# EAGLE schematic AniBike_v2.8_BT_MainBoard (EAGLE 5.08)

## Sheet 1 of 2
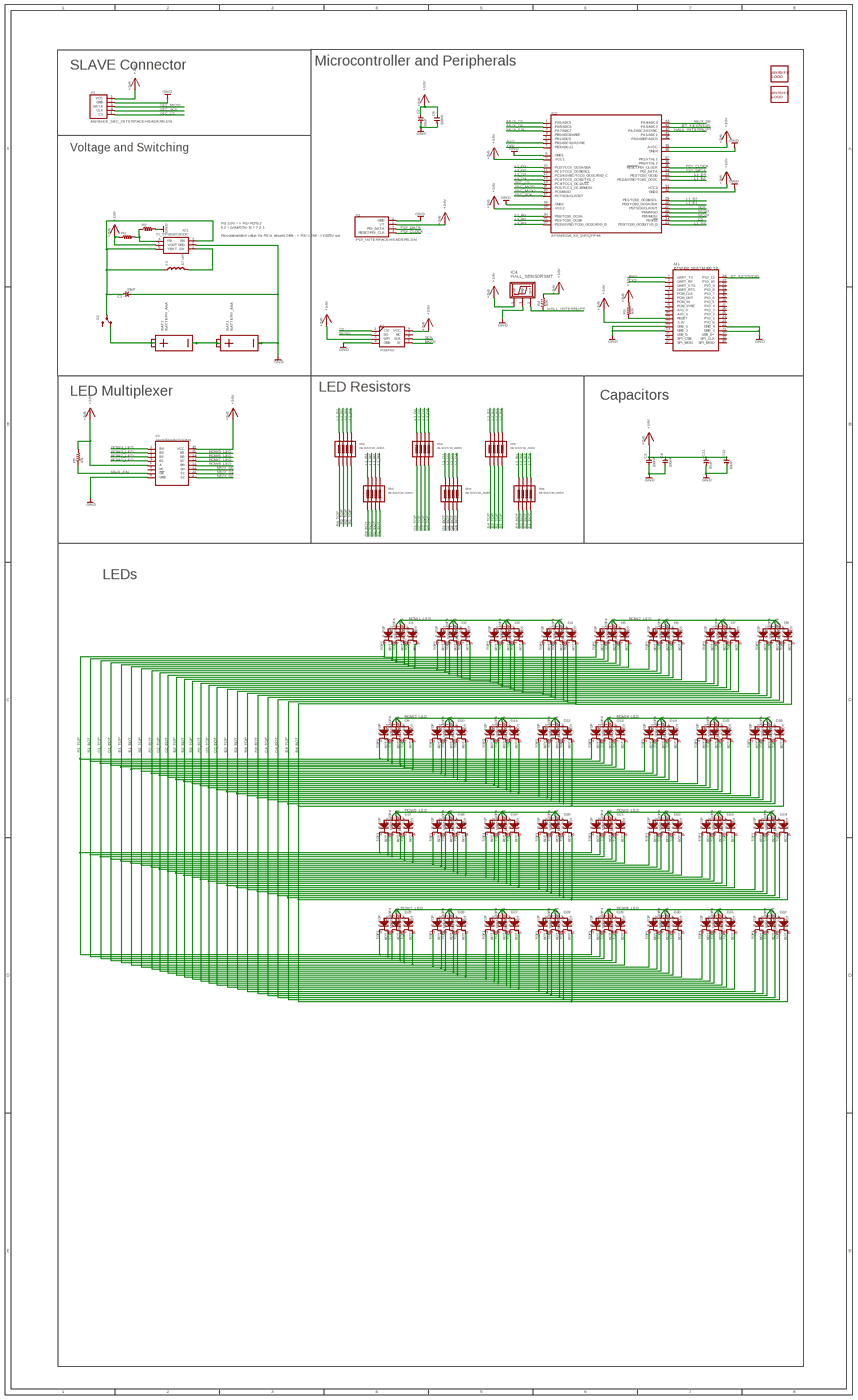
[diagram p0: schematic, sheet 1, overview]
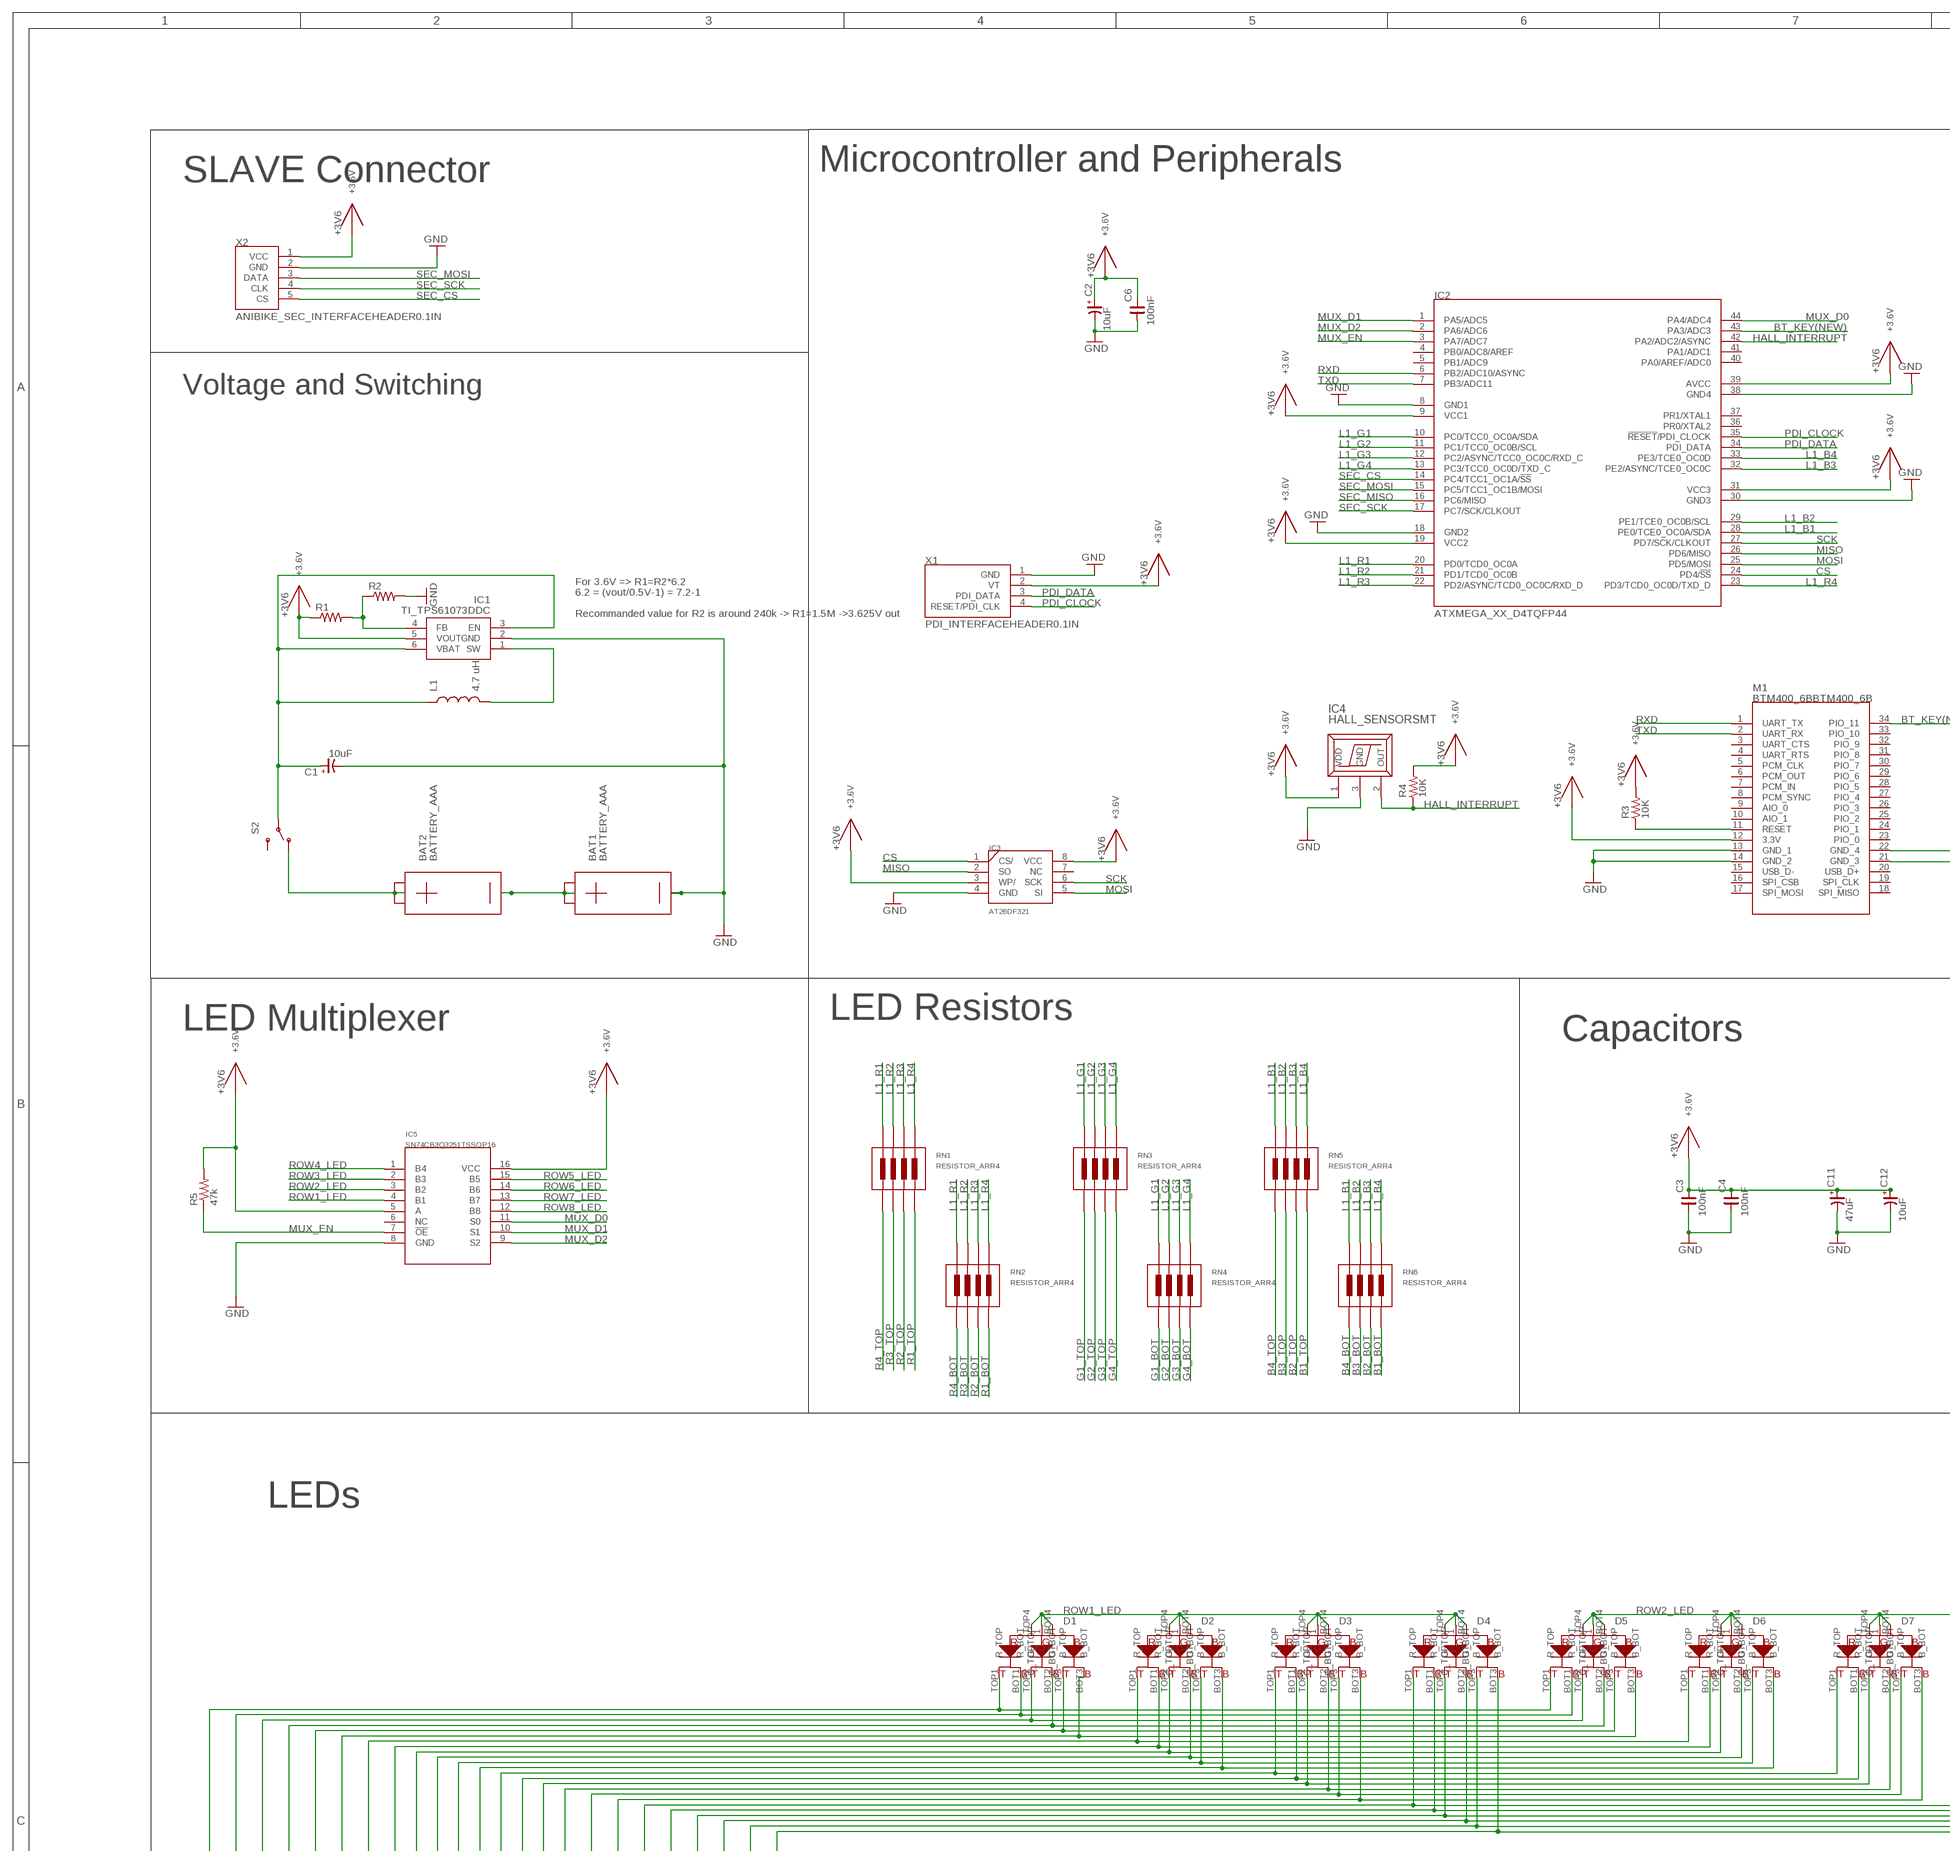
[diagram p1: schematic, sheet 1, part 1 of 4]
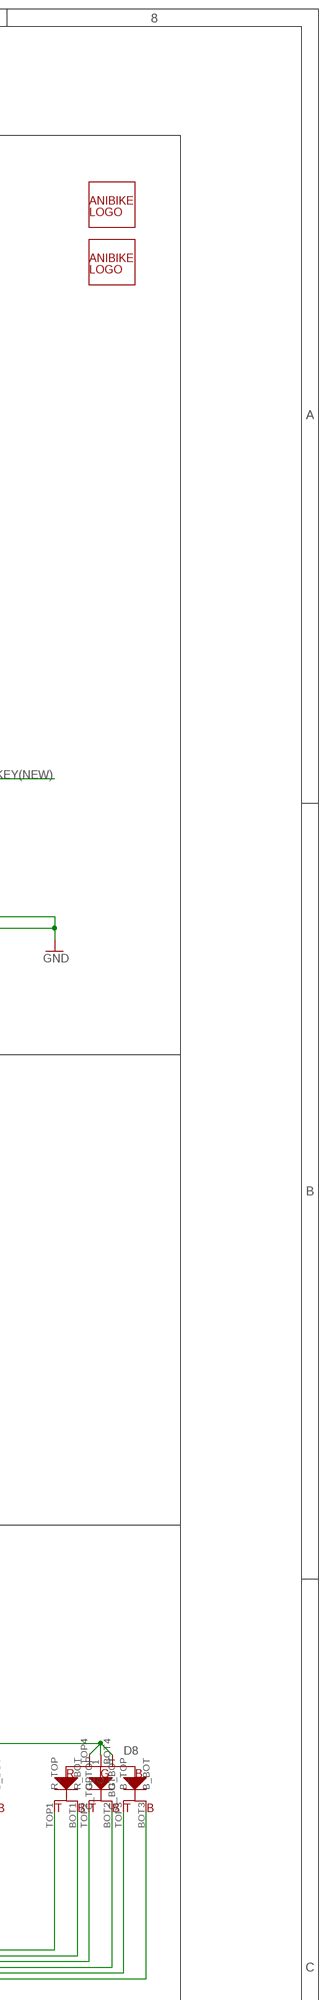
[diagram p2: schematic, sheet 1, part 2 of 4]
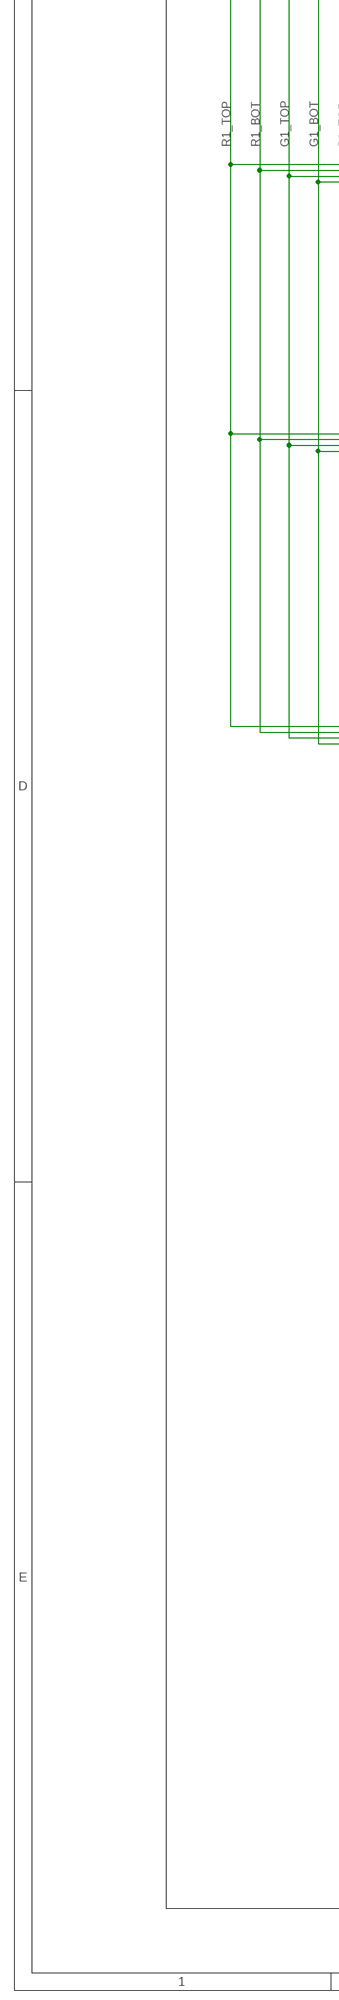
[diagram p3: schematic, sheet 1, part 3 of 4]
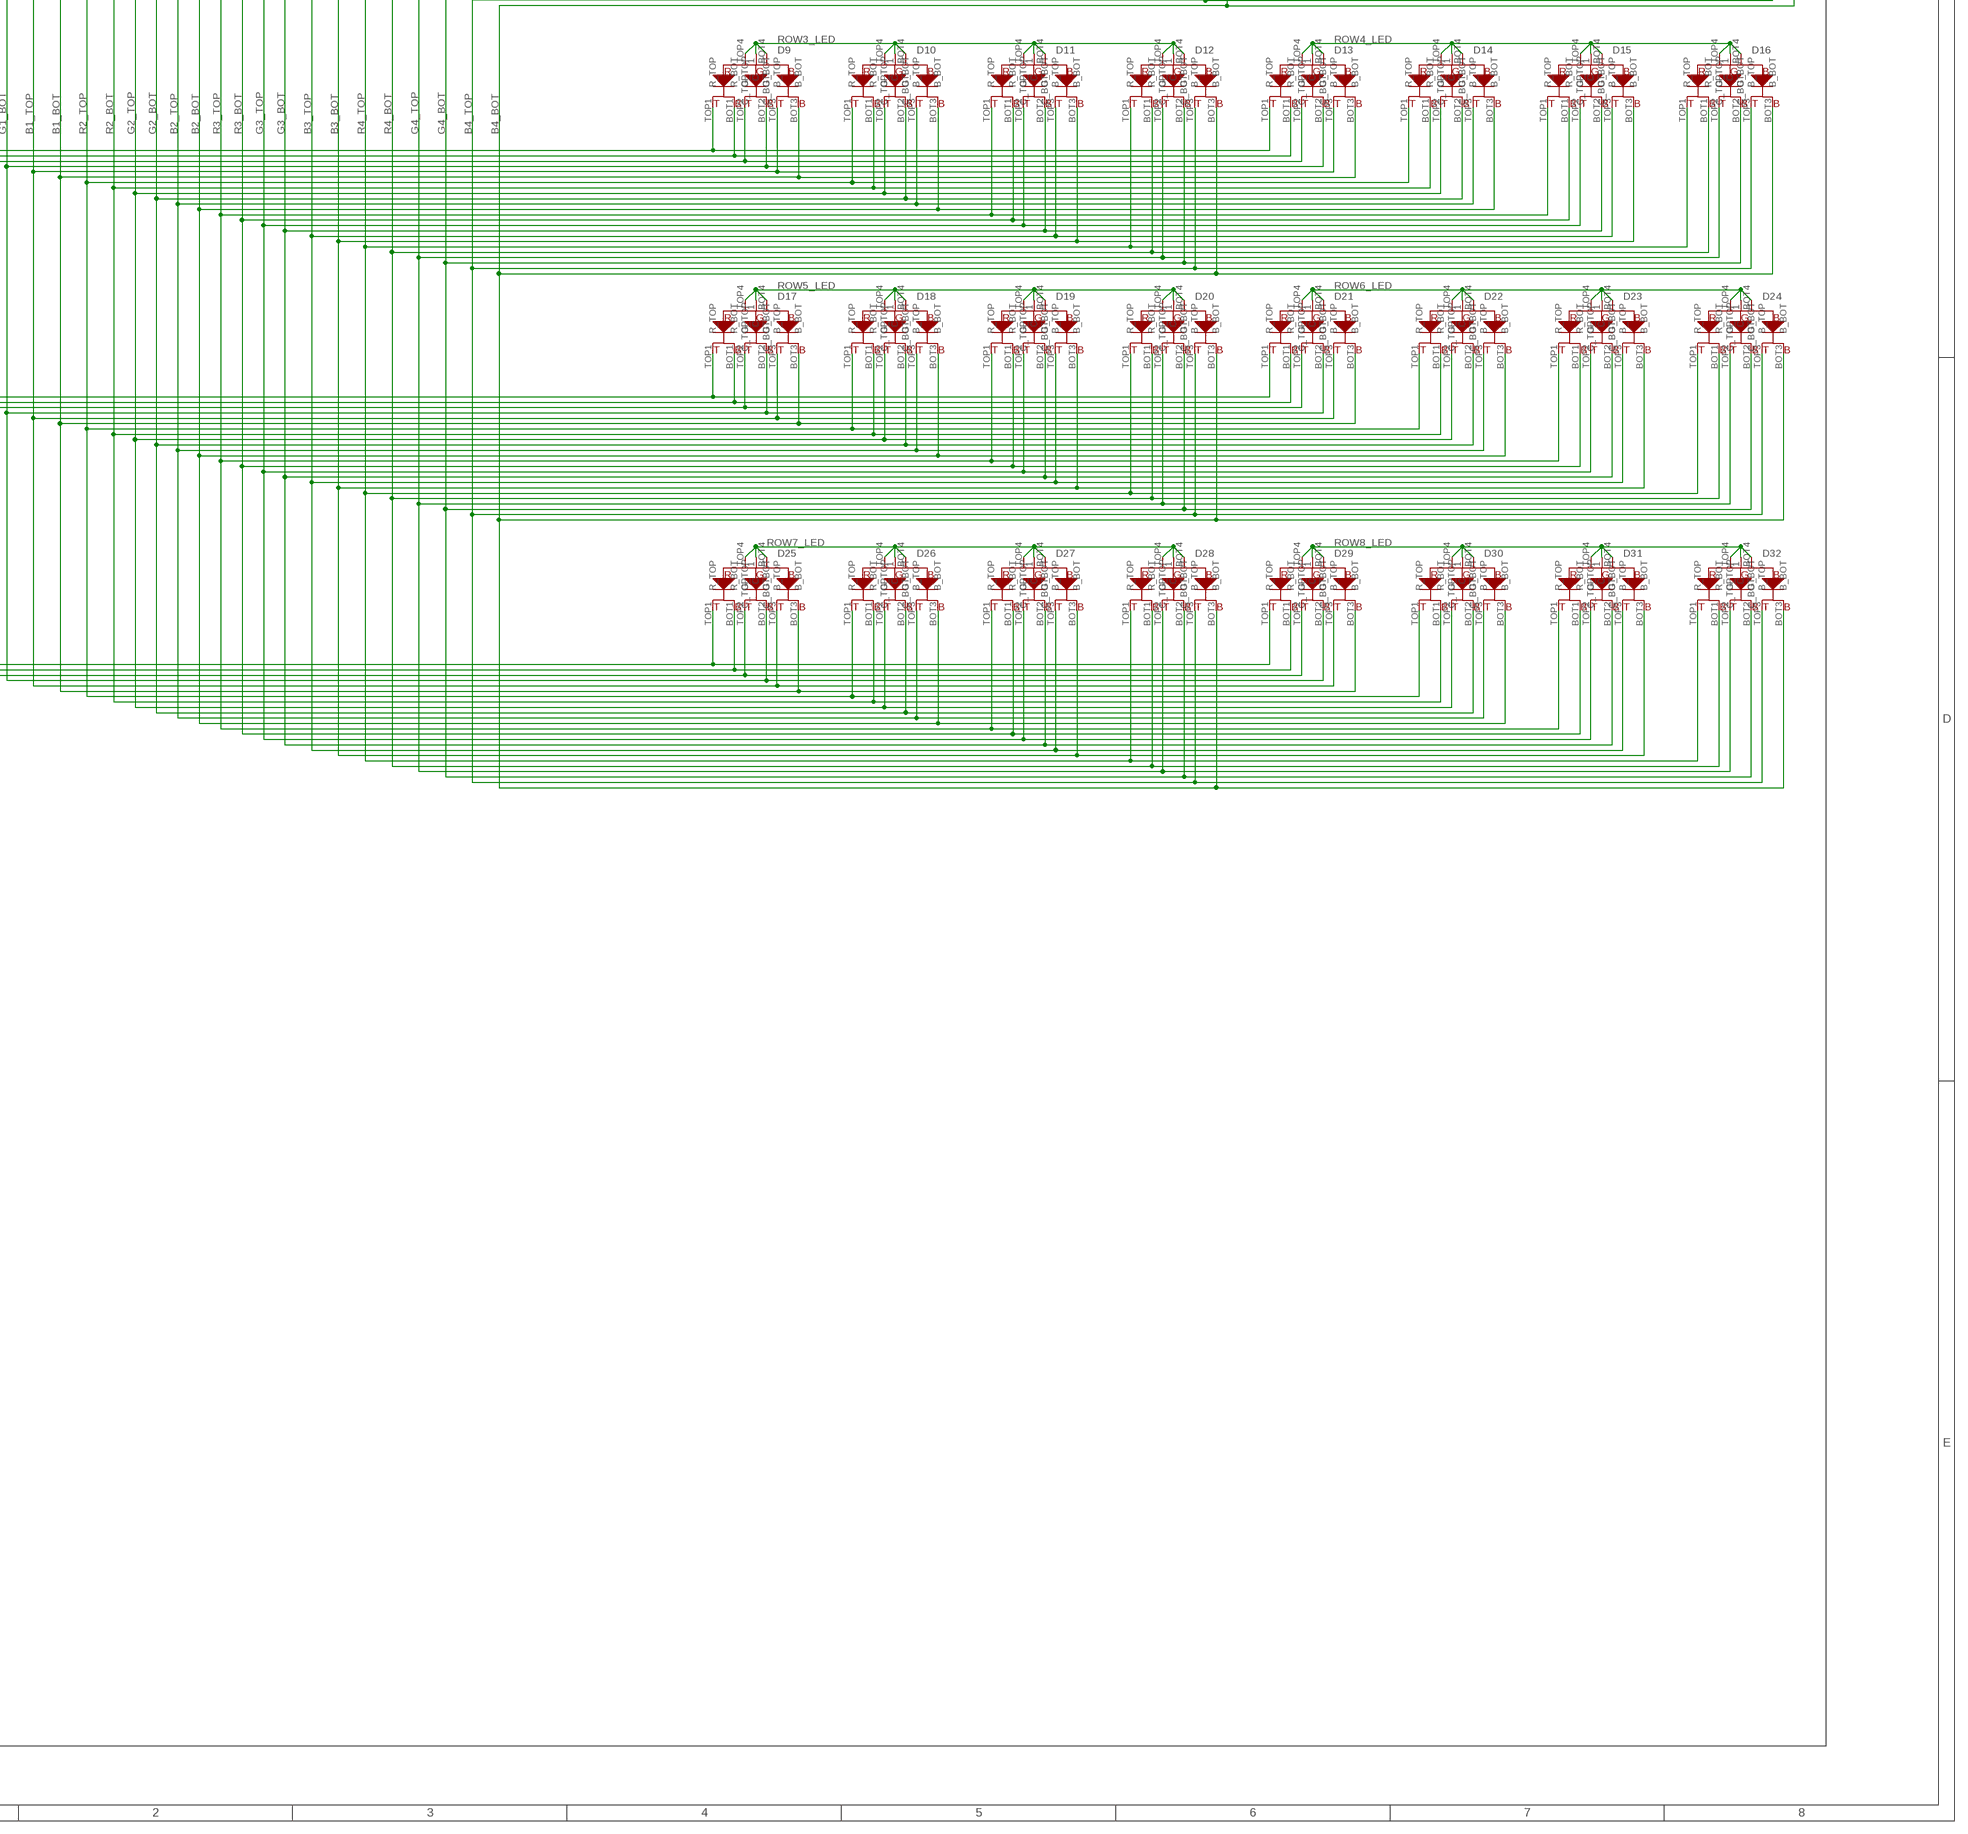
[diagram p4: schematic, sheet 1, part 4 of 4]

### Parts
BAT1  BATTERY_AAA  [BATTERY_AAA]
BAT2  BATTERY_AAA  [BATTERY_AAA]
C1  10uF  CP_3528-21  [C3528-21/T]
C2  10uF  CP_3528-21  [C3528-21/T]
C3  100nF  C_0805  [C0805]
C4  100nF  C_0805  [C0805]
C6  100nF  C_0805  [C0805]
C11  47uF  CP_3528-21  [C3528-21/T]
C12  10uF  CP_3528-21  [C3528-21/T]
D1  LED_RGB_DS_ISO  [LED1210_DS_ISO]
D2  LED_RGB_DS_ISO  [LED1210_DS_ISO]
D3  LED_RGB_DS_ISO  [LED1210_DS_ISO]
D4  LED_RGB_DS_ISO  [LED1210_DS_ISO]
D5  LED_RGB_DS_ISO  [LED1210_DS_ISO]
D6  LED_RGB_DS_ISO  [LED1210_DS_ISO]
D7  LED_RGB_DS_ISO  [LED1210_DS_ISO]
D8  LED_RGB_DS_ISO  [LED1210_DS_ISO]
D9  LED_RGB_DS_ISO  [LED1210_DS_ISO]
D10  LED_RGB_DS_ISO  [LED1210_DS_ISO]
D11  LED_RGB_DS_ISO  [LED1210_DS_ISO]
D12  LED_RGB_DS_ISO  [LED1210_DS_ISO]
D13  LED_RGB_DS_ISO  [LED1210_DS_ISO]
D14  LED_RGB_DS_ISO  [LED1210_DS_ISO]
D15  LED_RGB_DS_ISO  [LED1210_DS_ISO]
D16  LED_RGB_DS_ISO  [LED1210_DS_ISO]
D17  LED_RGB_DS_ISO  [LED1210_DS_ISO]
D18  LED_RGB_DS_ISO  [LED1210_DS_ISO]
D19  LED_RGB_DS_ISO  [LED1210_DS_ISO]
D20  LED_RGB_DS_ISO  [LED1210_DS_ISO]
D21  LED_RGB_DS_ISO  [LED1210_DS_ISO]
D22  LED_RGB_DS_ISO  [LED1210_DS_ISO]
D23  LED_RGB_DS_ISO  [LED1210_DS_ISO]
D24  LED_RGB_DS_ISO  [LED1210_DS_ISO]
D25  LED_RGB_DS_ISO  [LED1210_DS_ISO]
D26  LED_RGB_DS_ISO  [LED1210_DS_ISO]
D27  LED_RGB_DS_ISO  [LED1210_DS_ISO]
D28  LED_RGB_DS_ISO  [LED1210_DS_ISO]
D29  LED_RGB_DS_ISO  [LED1210_DS_ISO]
D30  LED_RGB_DS_ISO  [LED1210_DS_ISO]
D31  LED_RGB_DS_ISO  [LED1210_DS_ISO]
D32  LED_RGB_DS_ISO  [LED1210_DS_ISO]
IC1  TI_TPS61073DDC  [DDC]
IC2  ATXMEGA_XX_D4TQFP44  [TQFP44]
IC3  AT26DF321  [SOIC8]
IC4  HALL_SENSORSMT  [HALL_SENSOR_SE]
IC5  SN74CB3Q3251TSSOP16  [TSSOP16]
L1  4.7 uH  INDUCTOR1210  [1210]
M1  BTM400_6BBTM400_6B  [BTM400_6B]
R1  RESISTOR0603-RES  [0603-RES]
R2  RESISTOR0603-RES  [0603-RES]
R3  10K  R_0805  [R0805]
R4  10K  R_0805  [R0805]
R5  47k  RESISTOR0603-RES  [0603-RES]
RN1  RESISTOR_ARR4  [YCTC164]
RN2  RESISTOR_ARR4  [YCTC164]
RN3  RESISTOR_ARR4  [YCTC164]
RN4  RESISTOR_ARR4  [YCTC164]
RN5  RESISTOR_ARR4  [YCTC164]
RN6  RESISTOR_ARR4  [YCTC164]
S2  SWITCH-SPSTSMD2  [SWITCH-SPDT-SMD]
U$1  ANIBIKE_LOGOLOGO_3_MED  [ANIBIKE_LOGO_3_MEDIUM]
U$2  ANIBIKE_LOGOLOGO_6_BIG  [ANIBIKE_LOGO_6_BIG]
X1  PDI_INTERFACEHEADER0.1IN  [MOLEX-1X4_LOCK]
X2  ANIBIKE_SEC_INTERFACEHEADER0.1IN  ANIBIKE_SEC_INTERFACE  [MOLEX-1X5_LOCK]

### Nets
+3.6V: C2.+ C3.2 C4.2 C6.2 C11.+ C12.+ IC1.5(VOUT) IC2.9(VCC1) IC2.19(VCC2) IC2.31(VCC3) IC2.39(AVCC) IC3.3(WP/) IC3.8(VCC) IC4.1(VDD) IC5.5(A) IC5.16(VCC) M1.12(3.3V) R1.1 R3.2 R4.2 R5.2 X1.2(VT) X2.1(VCC) ; supply symbol labelled +3V6
B1_BOT: D1.BOT3(B_BOT) D5.BOT3(B_BOT) D9.BOT3(B_BOT) D13.BOT3(B_BOT) D17.BOT3(B_BOT) D21.BOT3(B_BOT) D25.BOT3(B_BOT) D29.BOT3(B_BOT) RN6.P$4
B1_TOP: D1.TOP3(B_TOP) D5.TOP3(B_TOP) D9.TOP3(B_TOP) D13.TOP3(B_TOP) D17.TOP3(B_TOP) D21.TOP3(B_TOP) D25.TOP3(B_TOP) D29.TOP3(B_TOP) RN5.P$4
B2_BOT: D2.BOT3(B_BOT) D6.BOT3(B_BOT) D10.BOT3(B_BOT) D14.BOT3(B_BOT) D18.BOT3(B_BOT) D22.BOT3(B_BOT) D26.BOT3(B_BOT) D30.BOT3(B_BOT) RN6.P$3
B2_TOP: D2.TOP3(B_TOP) D6.TOP3(B_TOP) D10.TOP3(B_TOP) D14.TOP3(B_TOP) D18.TOP3(B_TOP) D22.TOP3(B_TOP) D26.TOP3(B_TOP) D30.TOP3(B_TOP) RN5.P$3
B3_BOT: D3.BOT3(B_BOT) D7.BOT3(B_BOT) D11.BOT3(B_BOT) D15.BOT3(B_BOT) D19.BOT3(B_BOT) D23.BOT3(B_BOT) D27.BOT3(B_BOT) D31.BOT3(B_BOT) RN6.P$2
B3_TOP: D3.TOP3(B_TOP) D7.TOP3(B_TOP) D11.TOP3(B_TOP) D15.TOP3(B_TOP) D19.TOP3(B_TOP) D23.TOP3(B_TOP) D27.TOP3(B_TOP) D31.TOP3(B_TOP) RN5.P$2
B4_BOT: D4.BOT3(B_BOT) D8.BOT3(B_BOT) D12.BOT3(B_BOT) D16.BOT3(B_BOT) D20.BOT3(B_BOT) D24.BOT3(B_BOT) D28.BOT3(B_BOT) D32.BOT3(B_BOT) RN6.P$1
B4_TOP: D4.TOP3(B_TOP) D8.TOP3(B_TOP) D12.TOP3(B_TOP) D16.TOP3(B_TOP) D20.TOP3(B_TOP) D24.TOP3(B_TOP) D28.TOP3(B_TOP) D32.TOP3(B_TOP) RN5.P$1
BT_KEY(NEW): IC2.43(PA3/ADC3) M1.34(PIO_11)
CS: IC2.24(PD4/!SS!) IC3.1(CS/)
G1_BOT: D1.BOT2(G_BOT) D5.BOT2(G_BOT) D9.BOT2(G_BOT) D13.BOT2(G_BOT) D17.BOT2(G_BOT) D21.BOT2(G_BOT) D25.BOT2(G_BOT) D29.BOT2(G_BOT) RN4.P$1
G1_TOP: D1.TOP2(G_TOP) D5.TOP2(G_TOP) D9.TOP2(G_TOP) D13.TOP2(G_TOP) D17.TOP2(G_TOP) D21.TOP2(G_TOP) D25.TOP2(G_TOP) D29.TOP2(G_TOP) RN3.P$1
G2_BOT: D2.BOT2(G_BOT) D6.BOT2(G_BOT) D10.BOT2(G_BOT) D14.BOT2(G_BOT) D18.BOT2(G_BOT) D22.BOT2(G_BOT) D26.BOT2(G_BOT) D30.BOT2(G_BOT) RN4.P$2
G2_TOP: D2.TOP2(G_TOP) D6.TOP2(G_TOP) D10.TOP2(G_TOP) D14.TOP2(G_TOP) D18.TOP2(G_TOP) D22.TOP2(G_TOP) D26.TOP2(G_TOP) D30.TOP2(G_TOP) RN3.P$2
G3_BOT: D3.BOT2(G_BOT) D7.BOT2(G_BOT) D11.BOT2(G_BOT) D15.BOT2(G_BOT) D19.BOT2(G_BOT) D23.BOT2(G_BOT) D27.BOT2(G_BOT) D31.BOT2(G_BOT) RN4.P$3
G3_TOP: D3.TOP2(G_TOP) D7.TOP2(G_TOP) D11.TOP2(G_TOP) D15.TOP2(G_TOP) D19.TOP2(G_TOP) D23.TOP2(G_TOP) D27.TOP2(G_TOP) D31.TOP2(G_TOP) RN3.P$3
G4_BOT: D4.BOT2(G_BOT) D8.BOT2(G_BOT) D12.BOT2(G_BOT) D16.BOT2(G_BOT) D20.BOT2(G_BOT) D24.BOT2(G_BOT) D28.BOT2(G_BOT) D32.BOT2(G_BOT) RN4.P$4
G4_TOP: D4.TOP2(G_TOP) D8.TOP2(G_TOP) D12.TOP2(G_TOP) D16.TOP2(G_TOP) D20.TOP2(G_TOP) D24.TOP2(G_TOP) D28.TOP2(G_TOP) D32.TOP2(G_TOP) RN3.P$4
GND: BAT1.MINUS1 BAT1.MINUS2 C1.- C2.- C3.1 C4.1 C6.1 C11.- C12.- IC1.2(GND) IC2.8(GND1) IC2.18(GND2) IC2.30(GND3) IC2.38(GND4) IC3.4(GND) IC4.3(GND) IC5.8(GND) M1.13(GND_1) M1.14(GND_2) M1.21(GND_3) M1.22(GND_4) R2.2 X1.1(GND) X2.2(GND)
HALL_INTERRUPT: IC2.42(PA2/ADC2/ASYNC) IC4.2(OUT) R4.1
L1_B1: IC2.28(PE0/TCE0_OC0A/SDA) RN5.P$8 RN6.P$8
L1_B2: IC2.29(PE1/TCE0_OC0B/SCL) RN5.P$7 RN6.P$7
L1_B3: IC2.32(PE2/ASYNC/TCE0_OC0C) RN5.P$6 RN6.P$6
L1_B4: IC2.33(PE3/TCE0_OC0D) RN5.P$5 RN6.P$5
L1_G1: IC2.10(PC0/TCC0_OC0A/SDA) RN3.P$8 RN4.P$8
L1_G2: IC2.11(PC1/TCC0_OC0B/SCL) RN3.P$7 RN4.P$7
L1_G3: IC2.12(PC2/ASYNC/TCC0_OC0C/RXD_C) RN3.P$6 RN4.P$6
L1_G4: IC2.13(PC3/TCC0_OC0D/TXD_C) RN3.P$5 RN4.P$5
L1_R1: IC2.20(PD0/TCD0_OC0A) RN1.P$8 RN2.P$8
L1_R2: IC2.21(PD1/TCD0_OC0B) RN1.P$7 RN2.P$7
L1_R3: IC2.22(PD2/ASYNC/TCD0_OC0C/RXD_D) RN1.P$6 RN2.P$6
L1_R4: IC2.23(PD3/TCD0_OC0D/TXD_D) RN1.P$5 RN2.P$5
MISO: IC2.26(PD6/MISO) IC3.2(SO)
MOSI: IC2.25(PD5/MOSI) IC3.5(SI)
MUX_D0: IC2.44(PA4/ADC4) IC5.11(S0)
MUX_D1: IC2.1(PA5/ADC5) IC5.10(S1)
MUX_D2: IC2.2(PA6/ADC6) IC5.9(S2)
MUX_EN: IC2.3(PA7/ADC7) IC5.7(!OE!) R5.1
N$1: IC1.1(SW) L1.2
N$2: C1.+ IC1.3(EN) IC1.6(VBAT) L1.1 S2.2(P)
N$4: BAT1.PLUS1 BAT1.PLUS2 BAT2.MINUS1 BAT2.MINUS2
N$5: BAT2.PLUS1 BAT2.PLUS2 S2.1(O)
N$6: IC1.4(FB) R1.2 R2.1
N$8: M1.11(RESET) R3.1
PDI_CLOCK: IC2.35(!RESET!/PDI_CLOCK) X1.4(RESET/PDI_CLK)
PDI_DATA: IC2.34(PDI_DATA) X1.3(PDI_DATA)
R1_BOT: D1.BOT1(R_BOT) D5.BOT1(R_BOT) D9.BOT1(R_BOT) D13.BOT1(R_BOT) D17.BOT1(R_BOT) D21.BOT1(R_BOT) D25.BOT1(R_BOT) D29.BOT1(R_BOT) RN2.P$4
R1_TOP: D1.TOP1(R_TOP) D5.TOP1(R_TOP) D9.TOP1(R_TOP) D13.TOP1(R_TOP) D17.TOP1(R_TOP) D21.TOP1(R_TOP) D25.TOP1(R_TOP) D29.TOP1(R_TOP) RN1.P$4
R2_BOT: D2.BOT1(R_BOT) D6.BOT1(R_BOT) D10.BOT1(R_BOT) D14.BOT1(R_BOT) D18.BOT1(R_BOT) D22.BOT1(R_BOT) D26.BOT1(R_BOT) D30.BOT1(R_BOT) RN2.P$3
R2_TOP: D2.TOP1(R_TOP) D6.TOP1(R_TOP) D10.TOP1(R_TOP) D14.TOP1(R_TOP) D18.TOP1(R_TOP) D22.TOP1(R_TOP) D26.TOP1(R_TOP) D30.TOP1(R_TOP) RN1.P$3
R3_BOT: D3.BOT1(R_BOT) D7.BOT1(R_BOT) D11.BOT1(R_BOT) D15.BOT1(R_BOT) D19.BOT1(R_BOT) D23.BOT1(R_BOT) D27.BOT1(R_BOT) D31.BOT1(R_BOT) RN2.P$2
R3_TOP: D3.TOP1(R_TOP) D7.TOP1(R_TOP) D11.TOP1(R_TOP) D15.TOP1(R_TOP) D19.TOP1(R_TOP) D23.TOP1(R_TOP) D27.TOP1(R_TOP) D31.TOP1(R_TOP) RN1.P$2
R4_BOT: D4.BOT1(R_BOT) D8.BOT1(R_BOT) D12.BOT1(R_BOT) D16.BOT1(R_BOT) D20.BOT1(R_BOT) D24.BOT1(R_BOT) D28.BOT1(R_BOT) D32.BOT1(R_BOT) RN2.P$1
R4_TOP: D4.TOP1(R_TOP) D8.TOP1(R_TOP) D12.TOP1(R_TOP) D16.TOP1(R_TOP) D20.TOP1(R_TOP) D24.TOP1(R_TOP) D28.TOP1(R_TOP) D32.TOP1(R_TOP) RN1.P$1
ROW1_LED: D1.1(C) D1.BOT4(C_BOT) D1.TOP4(C_TOP) D2.1(C) D2.BOT4(C_BOT) D2.TOP4(C_TOP) D3.1(C) D3.BOT4(C_BOT) D3.TOP4(C_TOP) D4.1(C) D4.BOT4(C_BOT) D4.TOP4(C_TOP) IC5.4(B1)
ROW2_LED: D5.1(C) D5.BOT4(C_BOT) D5.TOP4(C_TOP) D6.1(C) D6.BOT4(C_BOT) D6.TOP4(C_TOP) D7.1(C) D7.BOT4(C_BOT) D7.TOP4(C_TOP) D8.1(C) D8.BOT4(C_BOT) D8.TOP4(C_TOP) IC5.3(B2)
ROW3_LED: D9.1(C) D9.BOT4(C_BOT) D9.TOP4(C_TOP) D10.1(C) D10.BOT4(C_BOT) D10.TOP4(C_TOP) D11.1(C) D11.BOT4(C_BOT) D11.TOP4(C_TOP) D12.1(C) D12.BOT4(C_BOT) D12.TOP4(C_TOP) IC5.2(B3)
ROW4_LED: D13.1(C) D13.BOT4(C_BOT) D13.TOP4(C_TOP) D14.1(C) D14.BOT4(C_BOT) D14.TOP4(C_TOP) D15.1(C) D15.BOT4(C_BOT) D15.TOP4(C_TOP) D16.1(C) D16.BOT4(C_BOT) D16.TOP4(C_TOP) IC5.1(B4)
ROW5_LED: D17.1(C) D17.BOT4(C_BOT) D17.TOP4(C_TOP) D18.1(C) D18.BOT4(C_BOT) D18.TOP4(C_TOP) D19.1(C) D19.BOT4(C_BOT) D19.TOP4(C_TOP) D20.1(C) D20.BOT4(C_BOT) D20.TOP4(C_TOP) IC5.15(B5)
ROW6_LED: D21.1(C) D21.BOT4(C_BOT) D21.TOP4(C_TOP) D22.1(C) D22.BOT4(C_BOT) D22.TOP4(C_TOP) D23.1(C) D23.BOT4(C_BOT) D23.TOP4(C_TOP) D24.1(C) D24.BOT4(C_BOT) D24.TOP4(C_TOP) IC5.14(B6)
ROW7_LED: D25.1(C) D25.BOT4(C_BOT) D25.TOP4(C_TOP) D26.1(C) D26.BOT4(C_BOT) D26.TOP4(C_TOP) D27.1(C) D27.BOT4(C_BOT) D27.TOP4(C_TOP) D28.1(C) D28.BOT4(C_BOT) D28.TOP4(C_TOP) IC5.13(B7)
ROW8_LED: D29.1(C) D29.BOT4(C_BOT) D29.TOP4(C_TOP) D30.1(C) D30.BOT4(C_BOT) D30.TOP4(C_TOP) D31.1(C) D31.BOT4(C_BOT) D31.TOP4(C_TOP) D32.1(C) D32.BOT4(C_BOT) D32.TOP4(C_TOP) IC5.12(B8)
RXD: IC2.6(PB2/ADC10/ASYNC) M1.1(UART_TX)
SCK: IC2.27(PD7/SCK/CLKOUT) IC3.6(SCK)
SEC_CS: IC2.14(PC4/TCC1_OC1A/!SS!) X2.5(CS)
SEC_MISO: IC2.16(PC6/MISO)
SEC_MOSI: IC2.15(PC5/TCC1_OC1B/MOSI) X2.3(DATA)
SEC_SCK: IC2.17(PC7/SCK/CLKOUT) X2.4(CLK)
TXD: IC2.7(PB3/ADC11) M1.2(UART_RX)
Unconnected: IC2.4(PB0/ADC8/AREF) IC2.5(PB1/ADC9) IC2.36(PR0/XTAL2) IC2.37(PR1/XTAL1) IC2.40(PA0/AREF/ADC0) IC2.41(PA1/ADC1) IC3.7(NC) IC5.6(NC) M1.3(UART_CTS) M1.4(UART_RTS) M1.5(PCM_CLK) M1.6(PCM_OUT) M1.7(PCM_IN) M1.8(PCM_SYNC) M1.9(AIO_0) M1.10(AIO_1) M1.15(USB_D-) M1.16(SPI_CSB) M1.17(SPI_MOSI) M1.18(SPI_MISO) M1.19(SPI_CLK) M1.20(USB_D+) M1.23(PIO_0) M1.24(PIO_1) M1.25(PIO_2) M1.26(PIO_3) M1.27(PIO_4) M1.28(PIO_5) M1.29(PIO_6) M1.30(PIO_7) M1.31(PIO_8) M1.32(PIO_9) M1.33(PIO_10) S2.3(S)

### Notes on the sheet
- SLAVE Connector | Microcontroller and Peripherals
- Voltage and Switching
- For 3.6V => R1=R2*6.2
- 6.2 = (vout/0.5V-1) = 7.2-1
- Recommanded value for R2 is around 240k -> R1=1.5M ->3.625V out
- LED Multiplexer | LED Resistors
- Capacitors
- LEDs

## Sheet 2 of 2

## Library data of the parts
BAT1 BAT2 = AniBike_Common_Library:BATTERY_AAA
C1 C11 C12 = AniBike_Common_Library:CP_: POLARIZED CAP
C2 = AniBike_v3.0_Library:CP_: POLARIZED CAP
C3 C6 = AniBike_Common_Library:C_: NON-POLARIZED CAP
C4 = AniBike_v3.0_Library:C_: NON-POLARIZED CAP
D1-D32 = AniBike_Common_Library:LED_RGB_DS_ISO
IC1 = AniBike_Common_Library:TI_TPS61073
IC2 = AniBike_Common_Library:ATXMEGA_XX_D4
IC3 = AniBike_v3.0_Library:AT26DF321
IC4 = AniBike_Common_Library:HALL_SENSOR
IC5 = AniBike_Common_Library:SN74CB3Q3251
L1 = SparkFun:INDUCTOR: Inductors Basic Inductor/Choke - 0603 and 1206. Footprints are not proven and vary greatly between part numbers.
M1 = AniBike_Common_Library:BTM400_6B
R1 R2 R5 = SparkFun:RESISTOR: Resistor Basic schematic elements and footprints for 0603, 1206, and PTH 1/10th watt (small) resistors.
R3 R4 = AniBike_v3.0_Library:R_: RESISTOR
RN1-RN6 = AniBike_Common_Library:RESISTOR_ARR4
S2 = SparkFun:SWITCH-SPST: SPST Switch Simple slide switch. Spark Fun Electronics SKU : COM-00102
U$1 U$2 = AniBike_Common_Library:ANIBIKE_LOGO
X1 = AniBike_Common_Library:PDI_INTERFACE
X2 = AniBike_Common_Library:ANIBIKE_SEC_INTERFACE